# EAGLE schematic Circuit-Schematic (EAGLE 9.2.0)
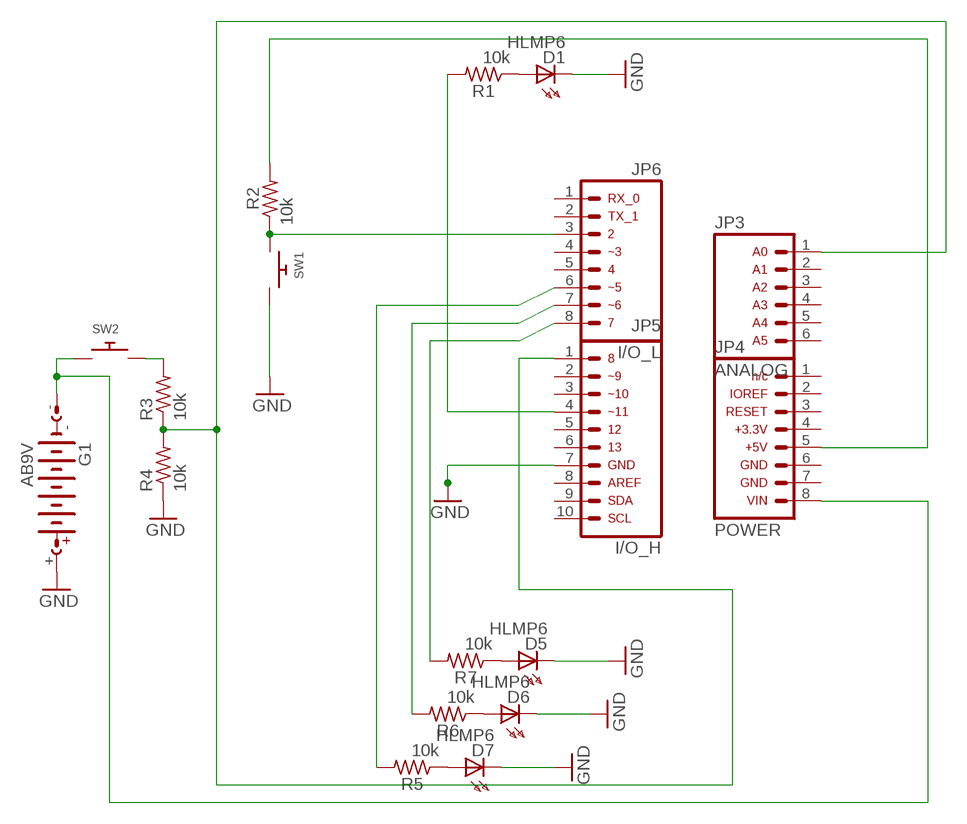
[diagram p0: schematic, sheet 1]

## Parts
D1  HLMP6  [HLMP6]
D5  HLMP6  [HLMP6]
D6  HLMP6  [HLMP6]
D7  HLMP6  [HLMP6]
G1  AB9V  [AB9V]
JP3  ARDUINO_CONN-ANALOGSIP  [CONN-1X06]
JP4  ARDUINO_CONN-POWERSIP  [CONN-1X08]
JP5  ARDUINO_CONN-IO_HSIP  [CONN-1X10]
JP6  ARDUINO_CONN-IO_LSIP  [CONN-1X08]
R1  10k  R-US_R0805  [R0805]
R2  10k  R-US_R0805  [R0805]
R3  10k  R-US_R0805  [R0805]
R4  10k  R-US_R0805  [R0805]
R5  10k  R-US_R0805  [R0805]
R6  10k  R-US_R0805  [R0805]
R7  10k  R-US_R0805  [R0805]
SW1  SWITCH_PUSHBUTTONSOFTTOUCHSMD_SJ  [PUSHBUTTON_SMD_SJ]
SW2  SWITCH_PUSHBUTTONSOFTTOUCHSMD_SJ  [PUSHBUTTON_SMD_SJ]

## Nets
GND: D1.K D5.K D6.K D7.K G1.+ JP5.7 R4.1 SW1.P$2
N$1: G1.- JP4.8 SW2.P$1
N$2: JP5.4 R1.2
N$3: D1.A R1.1
N$4: D5.A R7.1
N$5: JP6.3 R2.1 SW1.P$1
N$6: R3.2 SW2.P$2
N$7: D6.A R6.1
N$8: JP6.6 R5.2
N$9: D7.A R5.1
N$10: JP6.7 R6.2
N$11: JP6.8 R7.2
N$13: JP3.1 JP5.1 R3.1 R4.2
N$14: JP4.5 R2.2
Unconnected: JP3.2 JP3.3 JP3.4 JP3.5 JP3.6 JP4.1 JP4.2 JP4.3 JP4.4 JP4.6 JP4.7 JP5.2 JP5.3 JP5.5 JP5.6 JP5.8 JP5.9 JP5.10 JP6.1 JP6.2 JP6.4 JP6.5

## Library data of the parts
D1 D5-D7 = display-hp:HLMP6: LED 2mm horizontal; MF: AGILENT TECHNOLOGIES; MPN: HLMP-6500; OC_FARNELL: 1652490; OC_NEWARK: 40K0088
G1 = battery:AB9V: 9-V BATTERY CLIP
JP3 = arduino_jw:ARDUINO_CONN-ANALOG: Arduino Analog I/O Header This is the analog I/O header on the Arduino Uno R3. This connector is labeled with the following pin assignments: Analog 0 Analog 1 Analog 2 Analog 3 Analog 4 Analog 5 NOTE: Be sure you install this connector with the correct orientation on your PCB layout. Pin 1 has a square pad to assist with orientation.
JP4 = arduino_jw:ARDUINO_CONN-POWER: Arduino Power Header This is the power header on the Arduino Uno R3. This connector is labeled with the following pin assignments: n/c IO Ref RESET +3.3V +5V GND GND VIN NOTE: Be sure you install this connector with the correct orientation on your PCB layout. Pin 1 has a square pad to assist with orientation.
JP5 = arduino_jw:ARDUINO_CONN-IO_H: Arduino Digital I/O [High Byte] Header This is the Digital I/O [high byte] header on the Arduino Uno R3. This connector is labeled with the following pin assignments: Digital 8 Digital 9 [PWM] Digital 10 [PWM] Digital 11 [PWM] Digital 12 Digital 13 GND AREF SDA SCL NOTE: Be sure you install this connector with the correct orientation on your PCB layout. Pin 1 has a square pad to assist with orientation.
JP6 = arduino_jw:ARDUINO_CONN-IO_L: Arduino Digital I/O [Low Byte] Header This is the Digital I/O [low byte] header on the Arduino Uno R3. This connector is labeled with the following pin assignments: Digital 0, Serial Rx Digital 1, Serial Tx Digital 2 Digital 4 Digital 5 [PWM] Digital 6 [PWM] Digital 7 NOTE: Be sure you install this connector with the correct orientation on your PCB layout. Pin 1 has a square pad to assist with orientation.
R1-R7 = rcl:R-US_: RESISTOR, American symbol; SPICEPREFIX: R
SW1 SW2 = adafruit:SWITCH_PUSHBUTTON: Buttons SOFTTOUCHSMD_SJ - Soft touch temporary push button (Super Junk Akihabara) Compatible with SKPMANE010 [Mouser: 688-SKPMAN] C&K_KSS = Digikey: KSS221GLFS